# EAGLE schematic Mixer (EAGLE 7.7.0)
AUTHOR: Eltra EW; DESCRIPION: test; DESCRIPTION: Platine an Schlitten; VERSION: V1.0
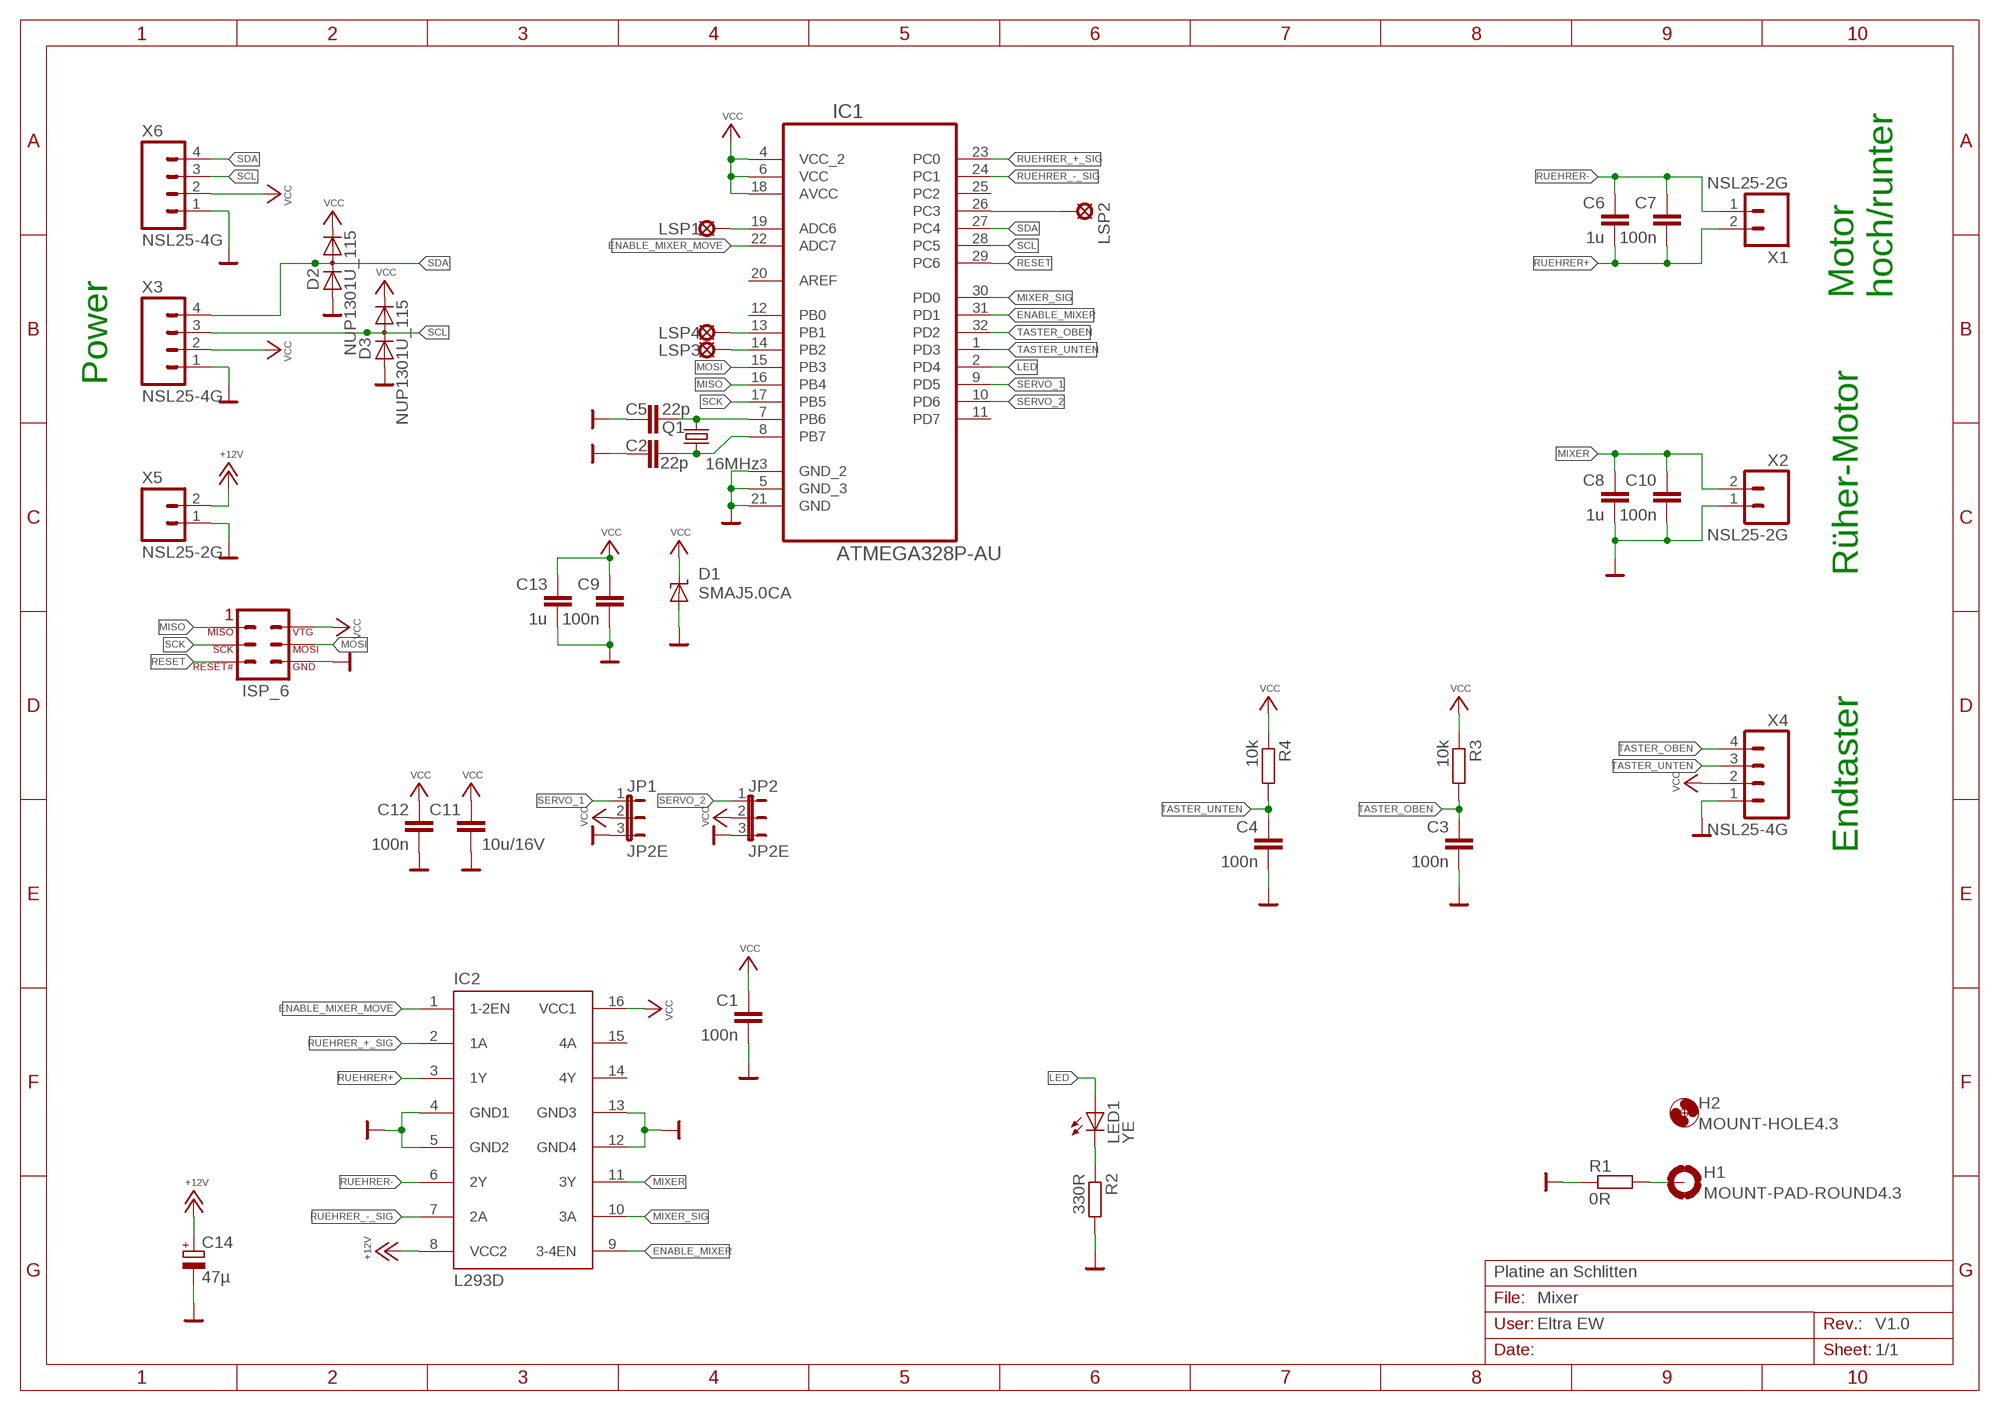
[diagram p0: schematic, sheet 1]

## Parts
C1  100n  C-EUC0805CRH  [0805CRH]
C2  22p  C-EUC0805CRH  [0805CRH]
C3  100n  C-EUC0805CRH  [0805CRH]
C4  100n  C-EUC0805CRH  [0805CRH]
C5  22p  C-EUC0805CRH  [0805CRH]
C6  1u  C-EUC0805CRH  [0805CRH]
C7  100n  C-EUC0805CRH  [0805CRH]
C8  1u  C-EUC0805CRH  [0805CRH]
C9  100n  C-EUC0805CRH  [0805CRH]
C10  100n  C-EUC0805CRH  [0805CRH]
C11  10u/16V  C-EUC0805CRH  [0805CRH]
C12  100n  C-EUC0805CRH  [0805CRH]
C13  1u  C-EUC0805CRH  [0805CRH]
C14  47µ  CPOL-EU153CLV-0405  [153CLV-0405]
D1  SMAJ5.0CA  SMAJ  [SMA-DO214AC]
D2  NUP1301U_115  [SOT323-3]
D3  NUP1301U_115  [SOT323-3]
H1  MOUNT-PAD-ROUND4.3  [4,3-PAD]
H2  MOUNT-HOLE4.3  [4,3]
IC1  ATMEGA328P-AU  [QFP80P900X900X120-32N]
IC2  L293D  [DIL16]
JP1  JP2E  [JP2]
JP2  JP2E  [JP2]
LED1  YE  LEDCHIPLED_0805  [CHIPLED_0805]
LSP1  LSP06  [LSP06]
LSP2  LSP06  [LSP06]
LSP3  LSP06  [LSP06]
LSP4  LSP06  [LSP06]
Q1  16MHz  CRYSTALHC49UP  [HC49UP]
R1  0R  R-EU_R0805CRH  [0805CRH]
R2  330R  R-EU_R0805CRH  [0805CRH]
R3  10k  R-EU_R0805CRH  [0805CRH]
R4  10k  R-EU_R0805CRH  [0805CRH]
SV1  ATMEL_ISP_6  [ML6]
X1  NSL25-2G  [NSL25-2G]
X2  NSL25-2G  [NSL25-2G]
X3  NSL25-4G  [NSL25-4G]
X4  NSL25-4G  [NSL25-4G]
X5  NSL25-2G  [NSL25-2G]
X6  NSL25-4G  [NSL25-4G]

## Nets
+12V: C14.+ IC2.8(VCC2) X5.2
ADC6: IC1.19(ADC6) LSP1.MP
ENABLE_MIXER: IC1.31(PD1) IC2.9(3-4EN)
ENABLE_MIXER_MOVE: IC1.22(ADC7) IC2.1(1-2EN)
GND: C1.2 C2.1 C3.2 C4.2 C5.1 C8.2 C9.2 C10.2 C11.2 C12.2 C13.2 C14.- D1.A D2.1 D3.1 IC1.3(GND_2) IC1.5(GND_3) IC1.21(GND) IC2.4(GND1) IC2.5(GND2) IC2.12(GND4) IC2.13(GND3) JP1.3 JP2.3 R1.1 R2.2 SV1.6 X2.1 X3.1 X4.1 X5.1 X6.1
LED: IC1.2(PD4) LED1.A
MISO: IC1.16(PB4) SV1.1
MIXER: C8.1 C10.1 IC2.11(3Y) X2.2
MIXER_SIG: IC1.30(PD0) IC2.10(3A)
MOSI: IC1.15(PB3) SV1.4
N$1: H1.B4,3(MOUNT) R1.2
N$2: LED1.C R2.1
N$3: IC1.26(PC3) LSP2.MP
N$4: C5.2 IC1.7(PB6) Q1.2
N$5: C2.2 IC1.8(PB7) Q1.1
N$6: IC1.14(PB2) LSP3.MP
N$7: IC1.13(PB1) LSP4.MP
RESET: IC1.29(PC6) SV1.5
RUEHRER+: C6.2 C7.2 IC2.3(1Y) X1.2
RUEHRER-: C6.1 C7.1 IC2.6(2Y) X1.1
RUEHRER_+_SIG: IC1.23(PC0) IC2.2(1A)
RUEHRER_-_SIG: IC1.24(PC1) IC2.7(2A)
SCK: IC1.17(PB5) SV1.3
SCL: D3.3 IC1.28(PC5) X3.3 X6.3
SDA: D2.3 IC1.27(PC4) X3.4 X6.4
SERVO_1: IC1.9(PD5) JP1.1
SERVO_2: IC1.10(PD6) JP2.1
TASTER_OBEN: C3.1 IC1.32(PD2) R3.2 X4.4
TASTER_UNTEN: C4.1 IC1.1(PD3) R4.2 X4.3
VCC: C1.1 C9.1 C11.1 C12.1 C13.1 D1.K(C) D2.2 D3.2 IC1.4(VCC_2) IC1.6(VCC) IC1.18(AVCC) IC2.16(VCC1) JP1.2 JP2.2 R3.1 R4.1 SV1.2 X3.2 X4.2 X6.2
Unconnected: IC1.11(PD7) IC1.12(PB0) IC1.20(AREF) IC1.25(PC2) IC2.14(4Y) IC2.15(4A)

## Notes on the sheet
- Motor
  hoch/runter
- Power
- Rüher-Motor
- Endtaster

## Library data of the parts
C1-C13 = rcl_jci:C-EU: CAPACITOR, European symbol
C14 = rcl_jci:CPOL-EU: POLARIZED CAPACITOR, European symbol
D1 = Eltra_Teile:SMAJ: Suppressor diode
D2 D3 = Diode:NUP1301U_115: ESD-Entstörer/TVS-Dioden, SOT-323-3
H1 = holes_sv:MOUNT-PAD-ROUND: MOUNTING PAD, round
H2 = holes_sv:MOUNT-HOLE: MOUNTING HOLE with drill center marker
IC1 = Atmel:ATMEGA328P-AU: 8-bit Microcontroller with In-System Programmable Flash; PACKAGE: TQFP-32; SUPPLIER: Atmel
IC2 = st-microelectronics:L293D: PUSH-PULL 4 CHANNEL DRIVER; MPN: L293D; OC_FARNELL: 9589619; OC_NEWARK: 56P8249
JP1 JP2 = jumper_jci:JP2E: JUMPER
LED1 = led_jci:LED: LED OSRAM: - CHIPLED LG R971, LG N971, LY N971, LG Q971, LY Q971, LO R971, LY R971 LH N974, LH R974 LS Q976, LO Q976, LY Q976 LO Q996 - Hyper CHIPLED LW Q18S LB Q993, LB Q99A, LB R99A - SideLED LS A670, LO A670, LY A670, LG A670, LP A670 LB A673, LV A673, LT A673, LW A673 LH A674 LY A675 LS A676, LA A676, LO A676, LY A676, LW A676 LS A679, LY A679, LG A679 - Hyper Micro SIDELED® LS Y876, LA Y876, LO Y876, LY Y876 LT Y87S - SmartLED LW L88C, LW L88S LB L89C, LB L89S, LG L890 LS L89K, LO L89K, LY L89K LS L896, LA L896, LO L896, LY L896 - TOPLED LS T670, LO T670, LY T670, LG T670, LP T670 LSG T670, LSP T670, LSY T670, LOP T670, LYG T670 LG T671, LOG T671, LSG T671 LB T673, LV T673, LT T673, LW T673 LH T674 LS T676, LA T676, LO T676, LY T676, LB T676, LH T676, LSB T676, LW T676 LB T67C, LV T67C, LT T67C, LS T67K, LO T67K, LY T67K, LW E67C LS E67B, LA E67B, LO E67B, LY E67B, LB E67C, LV E67C, LT E67C LW T67C LS T679, LY T679, LG T679 LS T770, LO T770, LY T770, LG T770, LP T770 LB T773, LV T773, LT T773, LW T773 LH T774 LS E675, LA E675, LY E675, LS T675 LS T776, LA T776, LO T776, LY T776, LB T776 LHGB T686 LT T68C, LB T68C - Hyper Mini TOPLED® LB M676 - Mini TOPLED Santana® LG M470 LS M47K, LO M47K, LY M47K Source: http://www.osram.convergy.de/
LSP1-LSP4 = solpad_jci:LSP: SOLDER PAD
Q1 = crystal_jci:CRYSTAL: CRYSTAL
R1-R4 = rcl_jci:R-EU_: RESISTOR, European symbol
SV1 = isp_jci:ATMEL_ISP_6: ATMEL ISP_6
X1 X2 X5 = con-nsk_jci:NSL25-2: Nylonstiftleiste
X3 X4 X6 = con-nsk_jci:NSL25-4: Nylonstiftleiste

## Net classes
0 default: clearance 0.205 mm